# EAGLE design board (EAGLE 9.3.0)
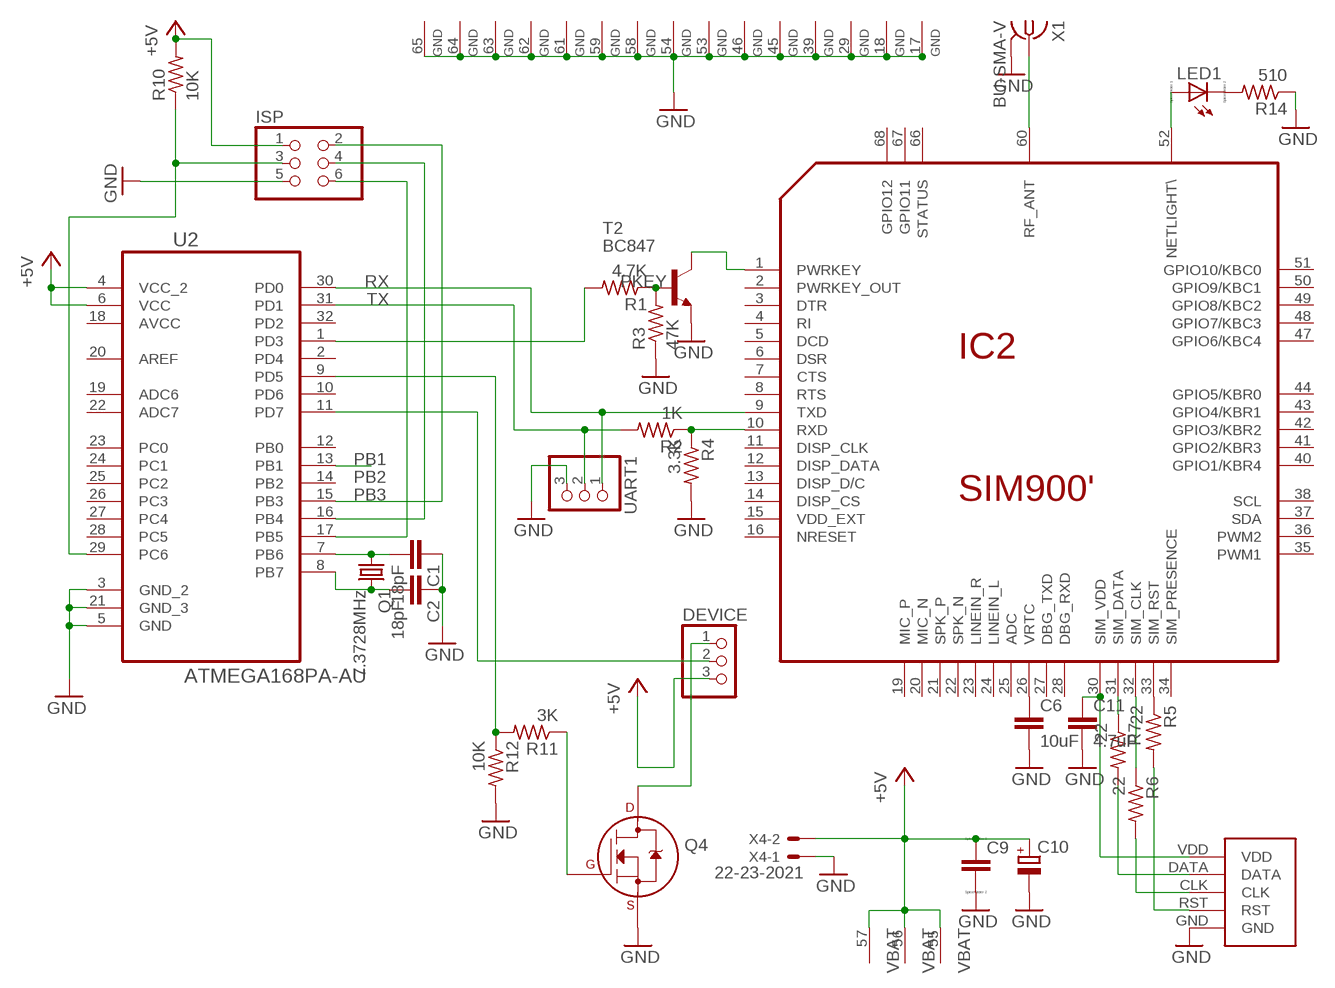
[diagram p0: schematic, sheet 1]

## Parts
C1  18pF  C-EUC1206  [C1206]
C2  18pF  C-EUC1206  [C1206]
C6  10uF  C-EUC1206  [C1206]
C9  C-EUC1206K  [C1206K]
C10  CPOL-EUE5-8.5  [E5-8,5]
C11  4.7uF  C-EUC1206  [C1206]
DEVICE  PINHD-1X3  [1X03]
IC2  SIM900'  [SIM900_NARROW]
ISP  PINHD-2X3  [2X03]
LED1  LED_E  [LED_1206]
Q1  7.3728MHz  CRYSTALHC49U-V  [HC49U-V]
Q4  2N700_SOT23_1  [SOT23]
R1  4.7K  R-US_R1206  [R1206]
R2  1K  R-US_R1206  [R1206]
R3  47K  R-US_R1206  [R1206]
R4  3.3K  R-US_R1206  [R1206]
R5  22  R-US_R1206  [R1206]
R6  22  R-US_R1206  [R1206]
R7  22  R-US_R1206  [R1206]
R10  10K  R-US_M1206  [M1206]
R11  3K  R-US_M1206  [M1206]
R12  10K  R-US_M1206  [M1206]
R14  510  R-US_R1206  [R1206]
SIM_HOLDER  115B-AAA0-R  [C707_10M006_512_2]
T2  BC847  [SOT23]
U2  ATMEGA168PA-AU  [QFP80P900X900X120-32N]
UART1  PINHD-1X3  [1X03]
X1  BU-SMA-V  [BU-SMA-V]
X4  22-23-2021  [22-23-2021]

## Nets
+5V: C9.1 C10.+ DEVICE.3 IC2.55(VBAT) IC2.56(VBAT) IC2.57(VBAT) ISP.1 R10.2 U2.4(VCC_2) U2.6(VCC) X4.2
GND: C1.1 C2.1 C6.2 C9.2 C10.- C11.2 IC2.17(GND) IC2.18(GND) IC2.29(GND) IC2.39(GND) IC2.45(GND) IC2.46(GND) IC2.53(GND) IC2.54(GND) IC2.58(GND) IC2.59(GND) IC2.61(GND) IC2.62(GND) IC2.63(GND) IC2.64(GND) IC2.65(GND) ISP.5 Q4.2(S) R3.1 R4.2 R12.2 R14.1 SIM_HOLDER.GND T2.2(E) U2.3(GND_2) U2.5(GND) U2.21(GND_3) UART1.3 X1.2 X1.3 X1.4 X1.5 X4.1
N$1: C1.2 Q1.1 U2.7(PB6)
N$2: DEVICE.2 U2.11(PD7)
N$3: Q4.1(G) R11.1
N$4: ISP.3 R10.1 U2.29(PC6)
N$5: ISP.4 U2.16(PB4)
N$6: ISP.6 U2.17(PB5)
N$7: IC2.1(PWRKEY) T2.3(C)
N$10: IC2.10(RXD) R2.1 R4.1
N$11: R1.1 R3.2 T2.1(B)
N$12: C2.2 Q1.2 U2.8(PB7)
N$17: IC2.52(NETLIGHT\) LED1.A
N$18: LED1.C R14.2
N$19: R5.2 SIM_HOLDER.RST
N$20: C11.1 IC2.30(SIM_VDD) SIM_HOLDER.VDD
N$21: C6.1 IC2.26(VRTC)
N$22: IC2.31(SIM_DATA) R7.1
N$24: IC2.32(SIM_CLK) R6.1
N$26: IC2.33(SIM_RST) R5.1
N$28: R7.2 SIM_HOLDER.DATA
N$29: IC2.60(RF_ANT) X1.1
N$45: DEVICE.1 Q4.3(D)
N$81: R6.2 SIM_HOLDER.CLK
PB1: U2.13(PB1)
PB2: R11.2 R12.1 U2.9(PD5)
PB3: ISP.2 U2.15(PB3)
PKEY: R1.2 U2.1(PD3)
RX: IC2.9(TXD) U2.30(PD0) UART1.1
TX: R2.2 U2.31(PD1) UART1.2
Unconnected: IC2.2(PWRKEY_OUT) IC2.3(DTR) IC2.4(RI) IC2.5(DCD) IC2.6(DSR) IC2.7(CTS) IC2.8(RTS) IC2.11(DISP_CLK) IC2.12(DISP_DATA) IC2.13(DISP_D/C) IC2.14(DISP_CS) IC2.15(VDD_EXT) IC2.16(NRESET) IC2.19(MIC_P) IC2.20(MIC_N) IC2.21(SPK_P) IC2.22(SPK_N) IC2.23(LINEIN_R) IC2.24(LINEIN_L) IC2.25(ADC) IC2.27(DBG_TXD) IC2.28(DBG_RXD) IC2.34(SIM_PRESENCE) IC2.35(PWM1) IC2.36(PWM2) IC2.37(SDA) IC2.38(SCL) IC2.40(GPIO1/KBR4) IC2.41(GPIO2/KBR3) IC2.42(GPIO3/KBR2) IC2.43(GPIO4/KBR1) IC2.44(GPIO5/KBR0) IC2.47(GPIO6/KBC4) IC2.48(GPIO7/KBC3) IC2.49(GPIO8/KBC2) IC2.50(GPIO9/KBC1) IC2.51(GPIO10/KBC0) IC2.66(STATUS) IC2.67(GPIO11) IC2.68(GPIO12) U2.2(PD4) U2.10(PD6) U2.12(PB0) U2.14(PB2) U2.19(ADC6) U2.20(AREF) U2.22(ADC7) U2.23(PC0) U2.24(PC1) U2.25(PC2) U2.26(PC3) U2.27(PC4) U2.28(PC5) U2.32(PD2)

## Power pins joined to a net without a drawn wire
AVCC: U2.18(AVCC)

## Library data of the parts
C1 C2 C6 C11 = rcl:C-EU: CAPACITOR, European symbol
C9 = resistor:C-EU: CAPACITOR, European symbol; SPICEPREFIX: C
C10 = resistor:CPOL-EU: POLARIZED CAPACITOR, European symbol
DEVICE UART1 = pinhead:PINHD-1X3: PIN HEADER
IC2 = sim900:SIM900: sim900 GPS module
ISP = pinhead:PINHD-2X3: PIN HEADER
LED1 = eagle-ltspice:LED_E: LED Source: http://www.osram.convergy.de Source: www.luxeon.com Source: www.kingbright.com; SPICEMODEL: NONE; SPICEPREFIX: D; SPICETYPE: diode
Q1 = crystal:CRYSTAL: CRYSTAL; OC_FARNELL: 1666969; OC_NEWARK: unknown
Q4 = transistors:2N700*: 2N7000, 2N7002, NDS7002A N-channel enhancement mode MOSFET
R1-R7 R10-R12 R14 = rcl:R-US_: RESISTOR, American symbol
SIM_HOLDER = Itead_BP_110825.lbr:115B-AAA0-R
T2 = transistor:BC847: NPN TRANSISTOR
U2 = Atmel_By_element14_Batch_1-00:ATMEGA168PA-AU: 8-bit Microcontroller; MPN: ATMEGA168PA-AU; OC_FARNELL: 1748516; OC_NEWARK: 26R5629; PACKAGE: TQFP-32; SUPPLIER: Atmel
X1 = con-coax:BU-SMA-V: FEMALE SMA CONNECTOR Radiall distributor RS 112-3794; OC_FARNELL: unknown; OC_NEWARK: unknown
X4 = con-molex:22-23-2021: .100" (2.54mm) Center Header - 2 Pin; MF: MOLEX; MPN: 22-23-2021; OC_FARNELL: 1462926; OC_NEWARK: 25C3832

## Board
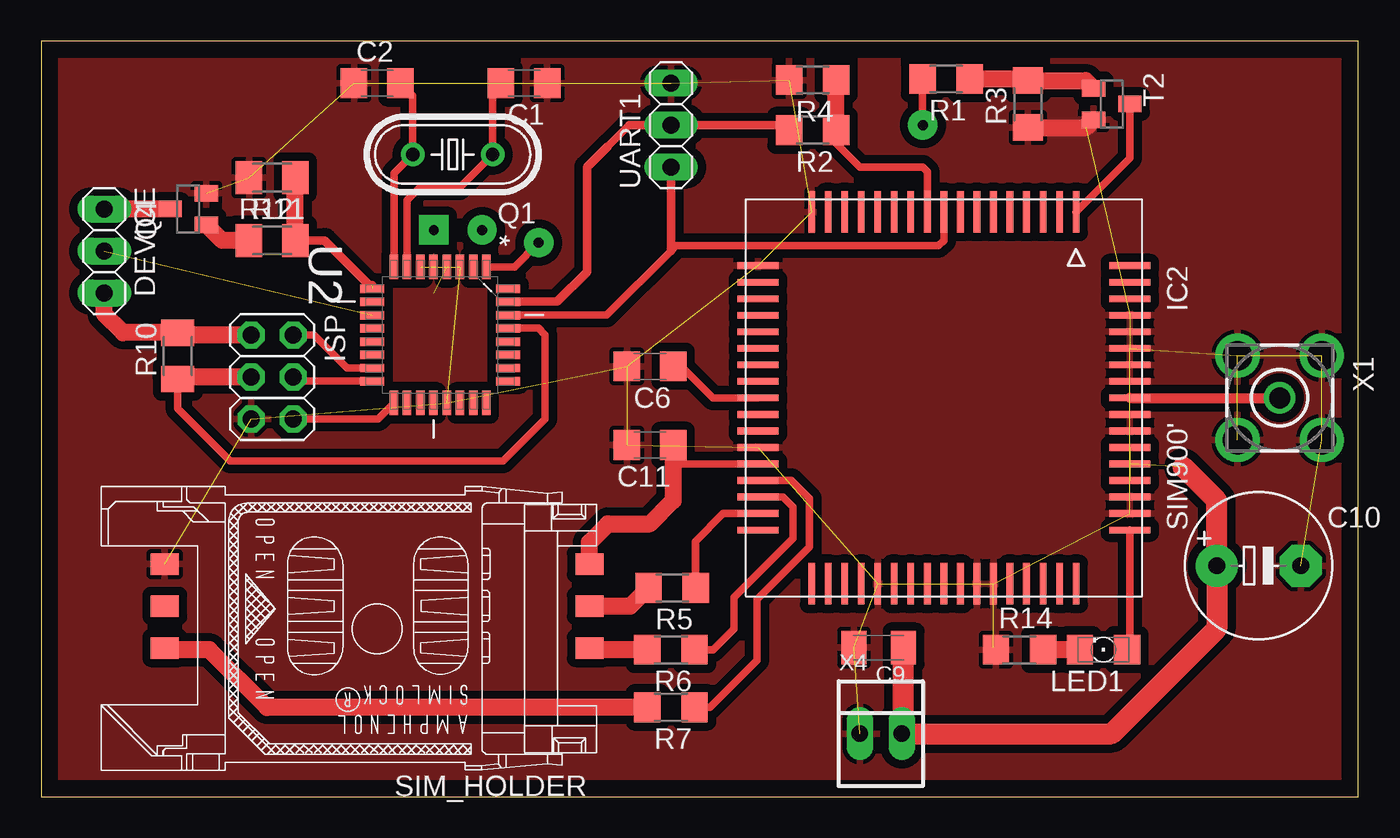
[diagram p1: board, top side]
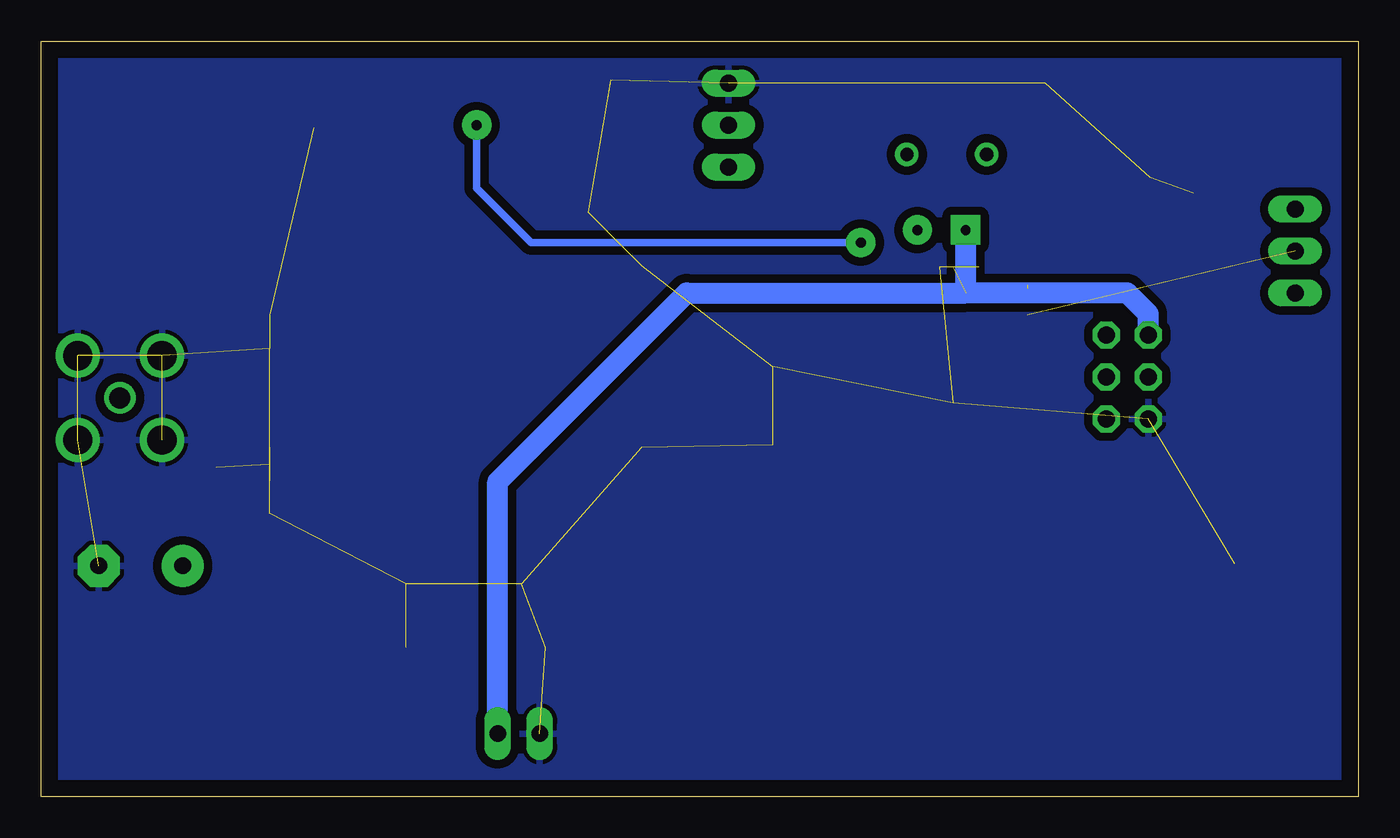
[diagram p2: board, bottom side, seen from below]

Size 79.68 x 45.71 mm. Coordinates in mm from the lower left corner, seen from the top.
Outline: 0,0 79.68,0 79.68,45.71 0,45.71 0,0
Copper layers (1*16): Top 0.035mm / dielectric 1.5mm / Bottom 0.035mm
Design rules "default": minimum track width 20mil, minimum drill 32mil, track to track 20mil, track to pad 20mil, pad to pad 20mil, via to via 20mil, smd to smd 16mil, copper to edge 40mil, drill to drill 40mil, minimum pad ring 12mil, minimum via ring 8mil, stop-mask expansion 4mil, vias tented up to drill 0mil, thermal gap 10mil

### Footprints (pad centres in the part's own frame; a part is rotated, then mirrored left to right if it is on the bottom)
C1206 = smd 1.6 x 1.8: 1 -1.4,0; 2 1.4,0
C1206K = smd 1.5 x 2: 1 -1.5,0; 2 1.5,0
E5-8,5 = drill 1.016 pad 2.54: + -2.54,0 | drill 1.016 pad 2.54 octagon: - 2.54,0
1X03 = drill 1.016 long: 1 -2.54,0; 2 0,0; 3 2.54,0
SIM900_NARROW = smd 2.5 x 0.406: 1 -11.25,8; 2 -11.25,7; 3 -11.25,6; 4 -11.25,5; 5 -11.25,4; 6 -11.25,3; 7 -11.25,2; 8 -11.25,1; 9 -11.25,0; 10 -11.25,-1; 11 -11.25,-2; 12 -11.25,-3; 13 -11.25,-4; 14 -11.25,-5; 15 -11.25,-6; 16 -11.25,-7; 17 -11.25,-8; 35 11.25,-8; 36 11.25,-7; 37 11.25,-6; 38 11.25,-5; 39 11.25,-4; 40 11.25,-3; 41 11.25,-2; 42 11.25,-1; 43 11.25,0; 44 11.25,1; 45 11.25,2; 46 11.25,3; 47 11.25,4; 48 11.25,5; 49 11.25,6; 50 11.25,7; 51 11.25,8 | smd 0.406 x 2.5: 18 -8,-11.25; 19 -7,-11.25; 20 -6,-11.25; 21 -5,-11.25; 22 -4,-11.25; 23 -3,-11.25; 24 -2,-11.25; 25 -1,-11.25; 26 0,-11.25; 27 1,-11.25; 28 2,-11.25; 29 3,-11.25; 30 4,-11.25; 31 5,-11.25; 32 6,-11.25; 33 7,-11.25; 34 8,-11.25; 52 8,11.25; 53 7,11.25; 54 6,11.25; 55 5,11.25; 56 4,11.25; 57 3,11.25; 58 2,11.25; 59 1,11.25; 60 0,11.25; 61 -1,11.25; 62 -2,11.25; 63 -3,11.25; 64 -4,11.25; 65 -5,11.25; 66 -6,11.25; 67 -7,11.25; 68 -8,11.25
2X03 = drill 1.016 octagon: 1 -2.54,-1.27; 2 -2.54,1.27; 3 0,-1.27; 4 0,1.27; 5 2.54,-1.27; 6 2.54,1.27
LED_1206 = smd 1.6 x 1.803: A -1.422,0; C 1.422,0
HC49U-V = drill 0.813: 1 -2.413,0; 2 2.413,0
SOT23 = smd 1 x 1.4: 1 -0.95,-1.1; 2 0.95,-1.1; 3 0,1.1
R1206 = smd 1.6 x 1.803: 1 -1.422,0; 2 1.422,0
M1206 = smd 1.6 x 2: 1 -1.4,0; 2 1.4,0
C707_10M006_512_2 = smd 1.7 x 1.3: CLK -12.85,1.165; DATA 12.85,1.165; GND 12.85,-3.915; NC 12.85,-1.375; RST -12.85,-1.375; VDD -12.85,-3.915
QFP80P900X900X120-32N = smd 1.473 x 0.508: 1 -4.115,2.794; 2 -4.115,2.007; 3 -4.115,1.194; 4 -4.115,0.406; 5 -4.115,-0.406; 6 -4.115,-1.194; 7 -4.115,-2.007; 8 -4.115,-2.794; 17 4.115,-2.794; 18 4.115,-2.007; 19 4.115,-1.194; 20 4.115,-0.406; 21 4.115,0.406; 22 4.115,1.194; 23 4.115,2.007; 24 4.115,2.794 | smd 0.508 x 1.473: 9 -2.794,-4.115; 10 -2.007,-4.115; 11 -1.194,-4.115; 12 -0.406,-4.115; 13 0.406,-4.115; 14 1.194,-4.115; 15 2.007,-4.115; 16 2.794,-4.115; 25 2.794,4.115; 26 2.007,4.115; 27 1.194,4.115; 28 0.406,4.115; 29 -0.406,4.115; 30 -1.194,4.115; 31 -2.007,4.115; 32 -2.794,4.115
BU-SMA-V = drill 1.27: 1 0,0 | drill 1.778: 2 -2.55,2.55; 3 2.55,2.55; 4 2.55,-2.55; 5 -2.55,-2.55
22-23-2021 = drill 1 long: 1 -1.27,0; 2 1.27,0

### Placement (x,y rotation side)
C1  29.21,43.18 180 top
C2  20.32,43.18 0 top
C6  36.83,26.04 180 top
C9  50.67,9.02 180 top
C10  73.66,13.97 0 top
C11  36.83,21.27 180 top
DEVICE  3.81,33.02 270 top
IC2  54.61,24.13 270 top
ISP  13.97,25.4 270 top
LED1  64.26,8.89 180 top
Q1  24.89,38.86 180 top
Q4  8.89,35.56 90 top
R1  54.74,43.43 180 top
R2  46.67,40.32 180 top
R3  59.69,41.91 90 top
R4  46.67,43.37 180 top
R5  38.16,12.64 180 top
R6  38.1,8.89 180 top
R7  38.1,5.4 180 top
R10  8.26,26.67 90 top
R11  13.97,33.66 0 top
R12  13.97,37.47 180 top
R14  59.18,8.89 0 top
SIM_HOLDER  20.32,10.16 180 top
T2  64.77,41.91 270 top
U2  24.13,27.94 270 top
UART1  38.1,40.64 90 top
X1  74.93,24.13 270 top
X4  50.8,3.81 0 top

### Tracks (layer width: path | path; a pad name or v marks a point on that pad's centre or on a via)
+5V  (5 unrouted)
  Top 1.016: DEVICE.3 3.81,29.21 4.95,28.07 R10.2 7.75,27.94 ISP.1
  Top 1.27: 69.09,19.94 71.12,17.91 C10.+ 71.12,10.16 64.77,3.81 X4.2 52.17,3.91 C9.1 52.07,8.91
  Bottom 1.27: 23.75,30.48 23.75,34.29 | X4.2 52.07,19.05 40.64,30.48 23.75,30.48 | ISP.1 12.7,29.21 13.97,30.48 23.75,30.48
GND  (36 unrouted)
  Top 0.457: 57.61,9.04 R14.1
  Top 1.016: R3.1 63.2,40.49 T2.2
  pour Top (isolate 0.254): 0,45.72 80.01,45.72 80.01,0 0,0
  pour Bottom (isolate 0.254): 0,45.72 80.01,45.72 80.01,0 0,0
N$1
  Top 0.457: U2.7 22.12,36.09 22.86,36.83 25.27,36.83 Q1.1 27.3,42.68 C1.2 27.31,42.68 27.31,42.55 27.94,43.18
N$2  (1 unrouted)
N$3
  Top 1.016: R11.1 10.94,33.66 Q4.1
N$4
  Top 0.457: U2.29 30.07,28.35 30.48,27.94 30.48,22.86 27.94,20.32 11.43,20.32 8.26,23.5 R10.1
  Top 1.016: ISP.3 7.75,25.4 R10.1
N$5
  Top 0.457: U2.16 15.49,25.15 ISP.4
N$6
  Top 0.457: ISP.6 20.37,22.86 U2.17
N$7
  Top 0.457: T2.3 65.87,38.64 IC2.1
N$8  (via drill 0.6 pad 1.78)
  other vias: 23.75,34.29
N$9  (via drill 0.6 pad 1.78)
  other vias: 26.67,34.29
N$10
  Top 0.457: IC2.10 53.61,37.83 53.34,38.1 49.53,38.1 48.09,39.54 R2.1
  Top 1.016: R2.1 R4.1
N$11
  Top 1.016: R1.1 59.59,43.43 R3.2 63.2,43.33 T2.1
N$12
  Top 0.457: U2.8 21.34,37.72 Q1.2 22.48,42.42 C2.2 22.35,42.55
N$17
  Top 0.457: IC2.52 65.86,9.07 LED1.A
N$18
  Top 1.016: LED1.C R14.2
N$19
  Top 1.016: SIM_HOLDER.RST 35.64,11.53 R5.2
N$20
  Top 0.457: IC2.30 38.42,20.13 38.23,20.32
  Top 1.016: SIM_HOLDER.VDD 33.17,15.39 34.29,16.51 36.83,16.51 38.23,17.91 38.23,20.32 C11.1
N$21
  Top 0.457: IC2.26 40.64,24.13 38.73,26.04 C6.1
N$22
  Top 0.457: R7.1 40.45,5.4 43.31,8.26 43.31,11.94 46.48,15.11 46.48,18.03 45.39,19.13 IC2.31
N$24
  Top 0.457: R6.1 40.64,8.89 41.91,10.16 41.91,12.06 45.47,15.62 45.47,17.53 44.86,18.13 IC2.32
N$26
  Top 0.457: R5.1 39.59,15.46 41.26,17.13 IC2.33
N$28
  Top 1.016: R7.2 13.65,5.4 10.16,8.89 7.58,8.89 SIM_HOLDER.DATA
N$29
  Top 0.61: IC2.60 X1.1
N$45
  Top 1.016: Q4.3 DEVICE.1
N$81
  Top 1.016: R6.2 33.27,8.89 SIM_HOLDER.CLK
PB2  (1 unrouted)
  Top 0.508: R11.2 17.14,33.66 19.84,30.96 20.02,30.96
  Top 1.016: R11.2 R12.1
PB3
  Top 0.457: U2.15 18.52,25.93 16.51,27.94 ISP.2
PKEY  (via drill 0.6 pad 1.78)
  Top 0.457: R1.2 53.32,40.66 v53.34,40.64 | U2.1 28.63,32.05 v30.1,33.53
  Bottom 0.457: v30.1,33.53 50.04,33.53 53.34,36.83 v53.34,40.64
RX
  Top 0.457: U2.30 34.21,29.13 38.1,33.02 38.42,33.34 54.29,33.34 54.61,33.66 IC2.9
  Top 0.508: UART1.1 38.1,33.02
TX
  Top 0.457: 35.56,40.64 34.29,39.37 | 44.93,40.64 R2.2
  Top 0.508: 35.56,40.64 UART1.2 44.93,40.64 | 34.29,39.37 33.02,38.1 33.02,31.75 31.22,29.95 U2.31